# Altium project Smart_water_bottle.PrjPcb
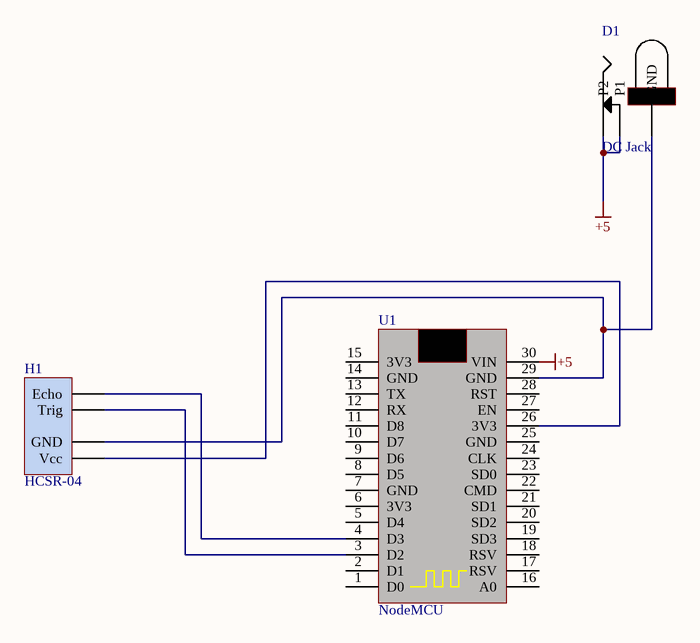
[diagram p0: SCH.SchDoc]
1 sheet, 3 parts. Net scope: global (net labels, ports and power ports of the same name join across sheets).
Board file: PCB.PcbDoc

## Sheet SCH.SchDoc
size A4

### Parts
D1  DC Jack  [DC Jack]
H1  HCSR-04  [HCSR-04]
U1  NodeMCU  [ESP8266]

### Nets
+5: D1.2(P2) D1.3(P1) U1.30(VIN)
NetD1_1: D1.1(GND) H1.1(GND) U1.29(GND)
NetH1_2: H1.2(Echo) U1.4(D3)
NetH1_3: H1.3(Trig) U1.3(D2)
NetH1_4: H1.4(Vcc) U1.26(3V3)

Not connected (* = marked no-connect by the designer): U1 1(D0) 2(D1) 5(D4) 6(3V3) 7(GND) 8(D5) 9(D6) 10(D7) 11(D8) 12(RX) 13(TX) 14(GND) 15(3V3) 16(A0) 17(RSV) 18(RSV) 19(SD3) 20(SD2) 21(SD1) 22(CMD) 23(SD0) 24(CLK) 25(GND) 27(EN) 28(RST)